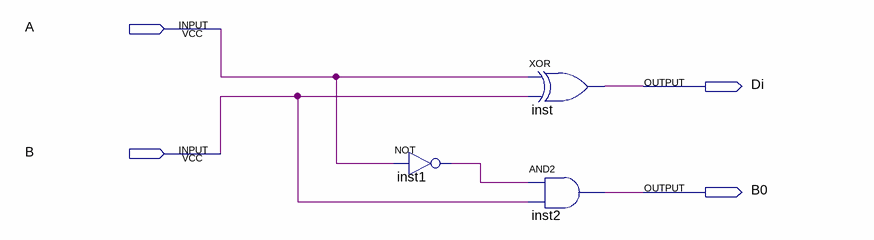
[diagram p0: schematic sheet]
// Quartus schematic Block1.bdf as structural Verilog: 3 symbols, 4 pins
module Block1 (
  input  A,
  input  B,
  output Di,
  output B0
);

  wire inst1_out;

  not inst1 (inst1_out, A);
  xor inst (Di, A, B);
  and inst2 (B0, inst1_out, B);
endmodule
